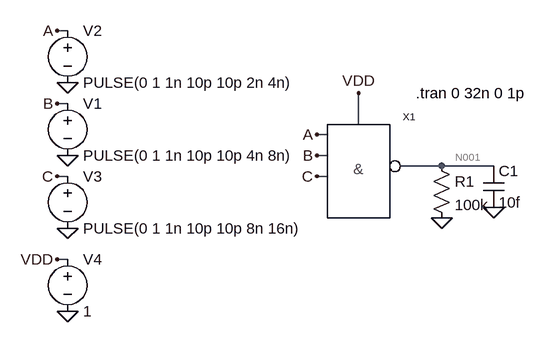
[diagram p0: schematic nand3_test.asc]
nand3_test.asc, the LTspice schematic file:
Version 4.1
SHEET 1 880 680
WIRE -16 -16 -32 -16
WIRE -16 96 -32 96
WIRE 432 128 432 80
WIRE 384 144 368 144
WIRE 384 176 368 176
WIRE 560 192 496 192
WIRE 640 192 560 192
WIRE -16 208 -32 208
WIRE 384 208 368 208
WIRE -16 336 -32 336
FLAG 560 272 0
FLAG 640 256 0
FLAG -16 288 0
FLAG -16 176 0
FLAG -16 64 0
FLAG -16 416 0
FLAG 368 144 A
FLAG -32 -16 A
FLAG 368 176 B
FLAG -32 96 B
FLAG 368 208 C
FLAG -32 208 C
FLAG -32 336 VDD
FLAG 432 80 VDD
SYMBOL nand3 432 192 R0
SYMATTR InstName X1
SYMBOL res 544 176 R0
SYMATTR InstName R1
SYMATTR Value 100k
SYMBOL cap 624 192 R0
SYMATTR InstName C1
SYMATTR Value 10f
SYMBOL voltage -16 192 R0
WINDOW 123 0 0 Left 0
WINDOW 39 0 0 Left 0
SYMATTR InstName V3
SYMATTR Value PULSE(0 1 1n 10p 10p 8n 16n)
SYMBOL voltage -16 320 R0
WINDOW 123 0 0 Left 0
WINDOW 39 0 0 Left 0
SYMATTR InstName V4
SYMATTR Value 1
SYMBOL voltage -16 80 R0
WINDOW 123 0 0 Left 0
WINDOW 39 0 0 Left 0
SYMATTR InstName V1
SYMATTR Value PULSE(0 1 1n 10p 10p 4n 8n)
SYMBOL voltage -16 -32 R0
WINDOW 123 0 0 Left 0
WINDOW 39 0 0 Left 0
SYMATTR InstName V2
SYMATTR Value PULSE(0 1 1n 10p 10p 2n 4n)
TEXT 520 80 Left 2 !.tran 0 32n 0 1p

The netlist it stands for:
* nand3_test.asc
X§X1 A B C VDD N001 nand3  ; pins A B C VDD Y
R1 N001 0 100k
C1 N001 0 10f
V3 C 0 PULSE(0 1 1n 10p 10p 8n 16n)
V4 VDD 0 1
V1 B 0 PULSE(0 1 1n 10p 10p 4n 8n)
V2 A 0 PULSE(0 1 1n 10p 10p 2n 4n)
.tran 0 32n 0 1p
.backanno
.end

* Results of the author's LTspice run, read from the files saved beside the schematic
* Operating Point, zero values left out:
*   V(vdd) = 1 V
*   V(n001) = 986.9 mV
*   I(R1) = 9.869 µA
*   I(V4) = -9.947 µA
*   I(V1) = 2.931 pA
*   I(V3) = 2.839 pA
*   I(V2) = 130.9 pA
*   Ix(x1:a) = -130.9 pA
*   Ix(x1:b) = -2.931 pA
*   Ix(x1:c) = -2.839 pA
*   Ix(x1:vdd) = 9.947 µA
*   Ix(x1:y) = -9.869 µA
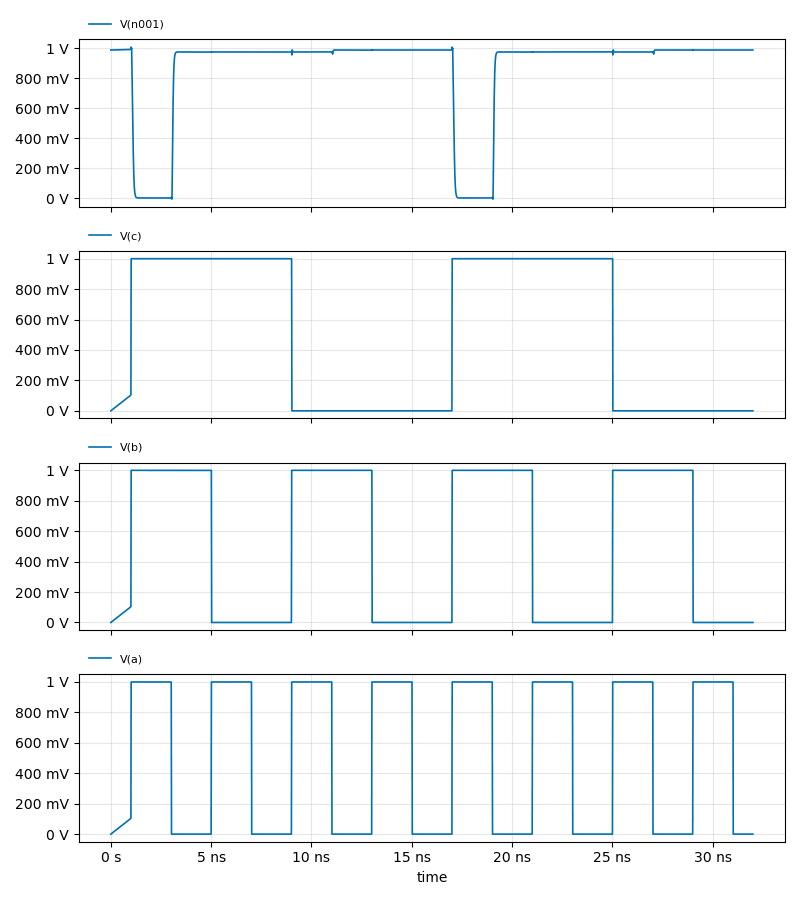
[diagram p1: Transient Analysis of nand3_test.asc, plotted from the saved traces]
* Transient Analysis, 1 run:
*   V(n001): min -8.165 mV, max 1.007 V, average 857.4 mV, rms 914.9 mV, last 986.8 mV
*   V(c): min 0 V, max 1 V, average 500.6 mV, rms 707.4 mV, last 0 V
*   V(b): min 0 V, max 1 V, average 501.2 mV, rms 707.7 mV, last 0 V
*   V(a): min 0 V, max 1 V, average 502.5 mV, rms 708.3 mV, last 0 V